# Altium schematic sheet Multi2Meter.SchDoc
size A3
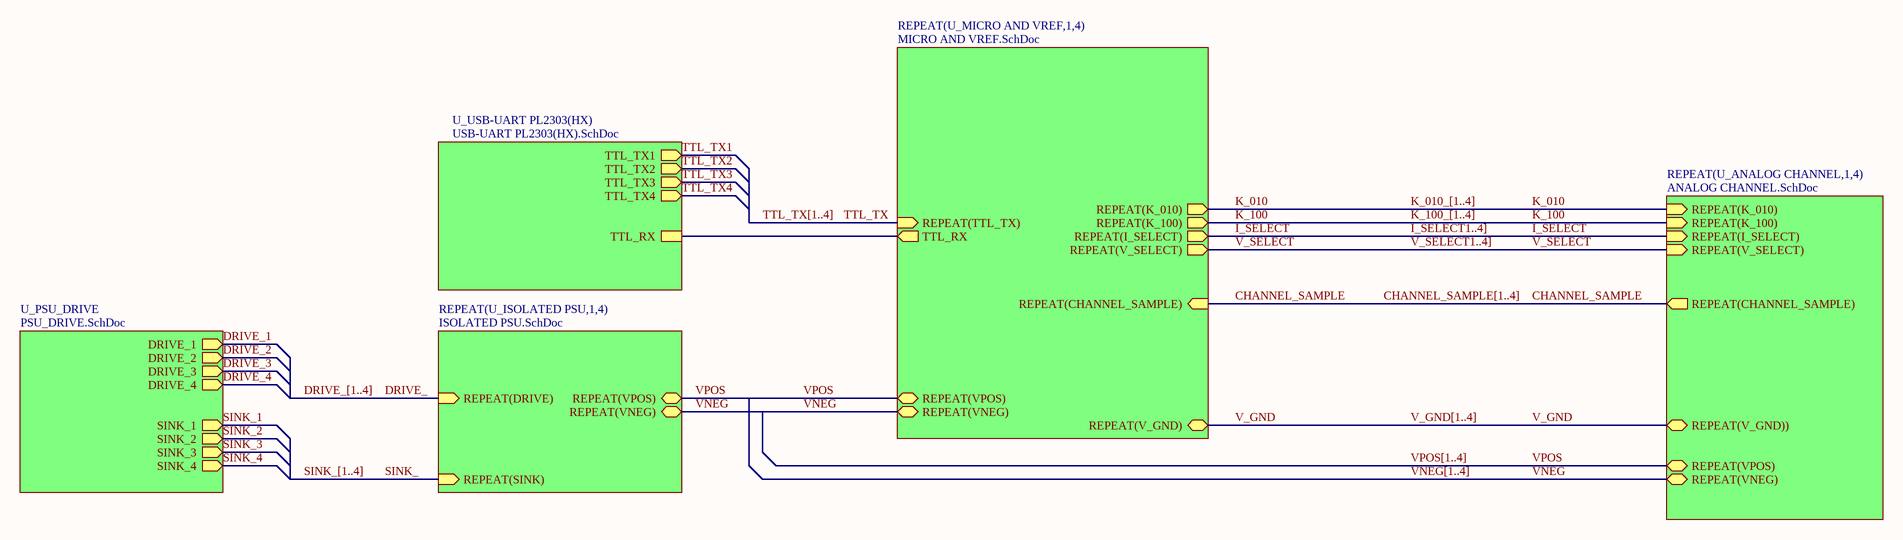
[diagram p0: Multi2Meter.SchDoc]

## Sub-sheets
REPEAT(U_ANALOG CHANNEL,1,4) = ANALOG CHANNEL.SchDoc: REPEAT(K_010) (in), REPEAT(K_100) (in), REPEAT(I_SELECT) (in), REPEAT(V_SELECT) (in), REPEAT(CHANNEL_SAMPLE) (out), REPEAT(V_GND)) (bidir), REPEAT(VPOS) (bidir), REPEAT(VNEG) (bidir)
REPEAT(U_ISOLATED PSU,1,4) = ISOLATED PSU.SchDoc: REPEAT(DRIVE) (in), REPEAT(SINK) (in), REPEAT(VPOS) (bidir), REPEAT(VNEG) (bidir)
REPEAT(U_MICRO AND VREF,1,4) = MICRO AND VREF.SchDoc: REPEAT(TTL_TX) (in), TTL_RX, REPEAT(K_010) (out), REPEAT(K_100) (out), REPEAT(I_SELECT) (out), REPEAT(V_SELECT) (out), REPEAT(CHANNEL_SAMPLE) (in), REPEAT(V_GND) (bidir), REPEAT(VPOS) (bidir), REPEAT(VNEG) (bidir)
U_PSU_DRIVE = PSU_DRIVE.SchDoc: DRIVE_1 (out), SINK_1 (out), DRIVE_2 (out), SINK_2 (out), DRIVE_3 (out), SINK_3 (out), DRIVE_4 (out), SINK_4 (out)
U_USB-UART PL2303(HX) = USB-UART PL2303(HX).SchDoc: TTL_TX1 (out), TTL_TX2 (out), TTL_TX3 (out), TTL_TX4 (out), TTL_RX

## Nets
CHANNEL_SAMPLE: sheet REPEAT(U_ANALOG CHANNEL,1,4)/REPEAT(CHANNEL_SAMPLE), sheet REPEAT(U_MICRO AND VREF,1,4)/REPEAT(CHANNEL_SAMPLE)
DRIVE_: sheet REPEAT(U_ISOLATED PSU,1,4)/REPEAT(DRIVE)
DRIVE_1: sheet U_PSU_DRIVE/DRIVE_1
DRIVE_2: sheet U_PSU_DRIVE/DRIVE_2
DRIVE_3: sheet U_PSU_DRIVE/DRIVE_3
DRIVE_4: sheet U_PSU_DRIVE/DRIVE_4
I_SELECT: sheet REPEAT(U_ANALOG CHANNEL,1,4)/REPEAT(I_SELECT), sheet REPEAT(U_MICRO AND VREF,1,4)/REPEAT(I_SELECT)
K_010: sheet REPEAT(U_ANALOG CHANNEL,1,4)/REPEAT(K_010), sheet REPEAT(U_MICRO AND VREF,1,4)/REPEAT(K_010)
K_100: sheet REPEAT(U_ANALOG CHANNEL,1,4)/REPEAT(K_100), sheet REPEAT(U_MICRO AND VREF,1,4)/REPEAT(K_100)
SINK_: sheet REPEAT(U_ISOLATED PSU,1,4)/REPEAT(SINK)
SINK_1: sheet U_PSU_DRIVE/SINK_1
SINK_2: sheet U_PSU_DRIVE/SINK_2
SINK_3: sheet U_PSU_DRIVE/SINK_3
SINK_4: sheet U_PSU_DRIVE/SINK_4
TTL_TX: sheet REPEAT(U_MICRO AND VREF,1,4)/REPEAT(TTL_TX)
TTL_TX1: sheet U_USB-UART PL2303(HX)/TTL_TX1
TTL_TX2: sheet U_USB-UART PL2303(HX)/TTL_TX2
TTL_TX3: sheet U_USB-UART PL2303(HX)/TTL_TX3
TTL_TX4: sheet U_USB-UART PL2303(HX)/TTL_TX4
V_GND: sheet REPEAT(U_ANALOG CHANNEL,1,4)/REPEAT(V_GND)), sheet REPEAT(U_MICRO AND VREF,1,4)/REPEAT(V_GND)
V_SELECT: sheet REPEAT(U_ANALOG CHANNEL,1,4)/REPEAT(V_SELECT), sheet REPEAT(U_MICRO AND VREF,1,4)/REPEAT(V_SELECT)
VNEG: sheet REPEAT(U_ANALOG CHANNEL,1,4)/REPEAT(VNEG), sheet REPEAT(U_MICRO AND VREF,1,4)/REPEAT(VNEG), sheet REPEAT(U_ISOLATED PSU,1,4)/REPEAT(VNEG)
VPOS: sheet REPEAT(U_ANALOG CHANNEL,1,4)/REPEAT(VPOS), sheet REPEAT(U_MICRO AND VREF,1,4)/REPEAT(VPOS), sheet REPEAT(U_ISOLATED PSU,1,4)/REPEAT(VPOS)
(unnamed): sheet REPEAT(U_MICRO AND VREF,1,4)/TTL_RX, sheet U_USB-UART PL2303(HX)/TTL_RX

## Buses and harness runs
bus CHANNEL_SAMPLE[1..4]
bus DRIVE_[1..4]
bus I_SELECT1..4]
bus K_010_[1..4]
bus K_100_[1..4]
bus SINK_[1..4]
bus TTL_TX[1..4]
bus V_GND[1..4]
bus V_SELECT1..4]
bus VNEG[1..4]
bus VPOS[1..4]